# Altium schematic sheet Power_A.SchDoc
size A4
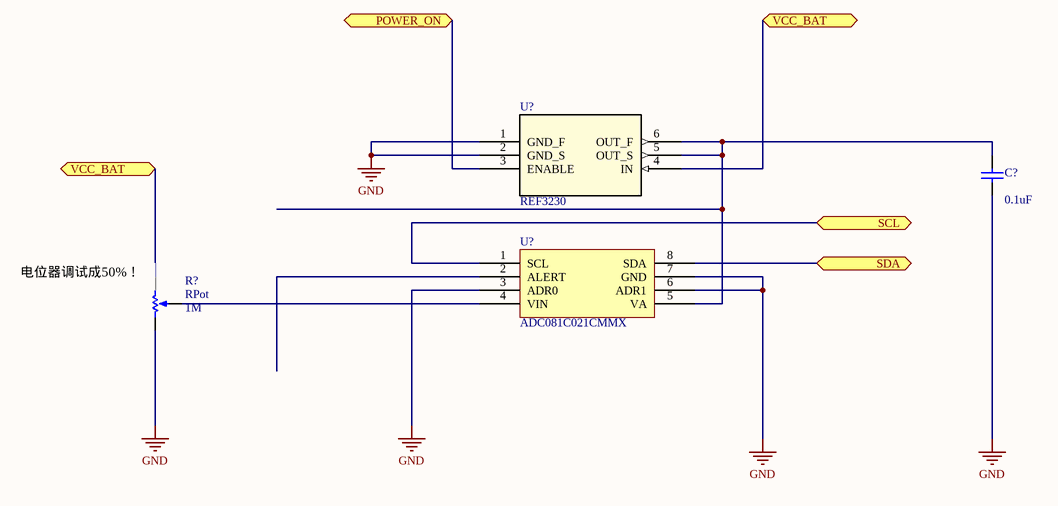
[diagram p0: Power_A.SchDoc]

## Parts
(Parts that share a designator on the sheet are numbered #1, #2 ... from top to bottom, then left to right.)
C?  value 0.1uF  [C1206]  (hidden comment: Cap Semi)
R?  RPot  value 1M  [VR5]
U?#1  REF3230  [DBV6]
U?#2  ADC081C021CMMX

## Ports
POWER_ON (bidir), SCL (bidir), SDA (bidir), VCC_BAT (bidir)

## Nets
GND: C?.1 R?.2(BOT) U?#1.1(GND_F) U?#1.2(GND_S) U?#2.3(ADR0) U?#2.6(ADR1) U?#2.7(GND)
POWER_ON: U?#1.3(ENABLE) ; port POWER_ON
SCL: U?#2.1(SCL) ; port SCL
SDA: U?#2.8(SDA) ; port SDA
VCC_BAT: R?.1(TOP) U?#1.4(IN) ; port VCC_BAT
NetC?_2: C?.2 U?#1.5(OUT_S) U?#1.6(OUT_F) U?#2.5(VA)
NetR?_3: R?.3(TAP) U?#2.4(VIN)

Not connected (* = marked no-connect by the designer): U?#2 2(ALERT)

## Notes on the sheet
- (near R?) 电位器调试成50%！

## Library data of the parts
C? = Cap Semi: Capacitor (Semiconductor SIM Model); Published: 8-Jun-2000; LatestRevisionDate: 29-May-2009; LatestRevisionNote: IPC-7351 Footprint Added.; PackageReference: C1206; Publisher: Altium Limited; PackageDescription: Chip Capacitor
R? = RPot: Potentiometer; Sim Note: Enter the Resistance value and the set point into parameter fields.; Set Position: 0.5; Published: 8-Jun-2000; LatestRevisionDate: 17-Jul-2002; LatestRevisionNote: Re-released for DXP Platform.; PackageReference: VR5; Publisher: Altium Limited; PackageDescription: Variable Resistor, Thru-Hole; 3 Leads
U?#1 = REF3230: Imported; Manufacturer: Texas Instruments; Manufacturer_Part_Number: ref3230_dbv_6; INDUSTRY_STD_PKG_TYPE: SOT-23; FAMILY_NAME: SERIES VOLTAGE REFERENCE; PIN_COUNT: 6; PACKAGE_DESIGNATOR: DBV; Datasheet URL: http://www.ti.com/lit/gpn/REF3230; GENERIC_PART_NUMBER: REF3230; Vendor: Texas Instruments; RefDes: RefDes; Type: DEV; Value: Value